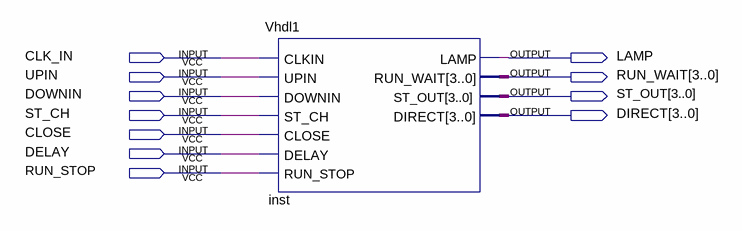
[diagram p0: schematic sheet]
// Quartus schematic Block1.bdf as structural Verilog: 1 symbols, 11 pins
module Block1 (
  input  CLK_IN,
  input  UPIN,
  input  DOWNIN,
  input  ST_CH,
  input  CLOSE,
  input  DELAY,
  input  RUN_STOP,
  output LAMP,
  output [3:0] RUN_WAIT,
  output [3:0] ST_OUT,
  output [3:0] DIRECT
);

  Vhdl1 inst (
    .CLKIN(CLK_IN), .UPIN(UPIN), .DOWNIN(DOWNIN), .ST_CH(ST_CH), .CLOSE(CLOSE), .DELAY(DELAY),
    .RUN_STOP(RUN_STOP), .LAMP(LAMP), .RUN_WAIT(RUN_WAIT), .ST_OUT(ST_OUT), .DIRECT(DIRECT));
endmodule
